# Altium schematic sheet SD_CARD.SchDoc
size A
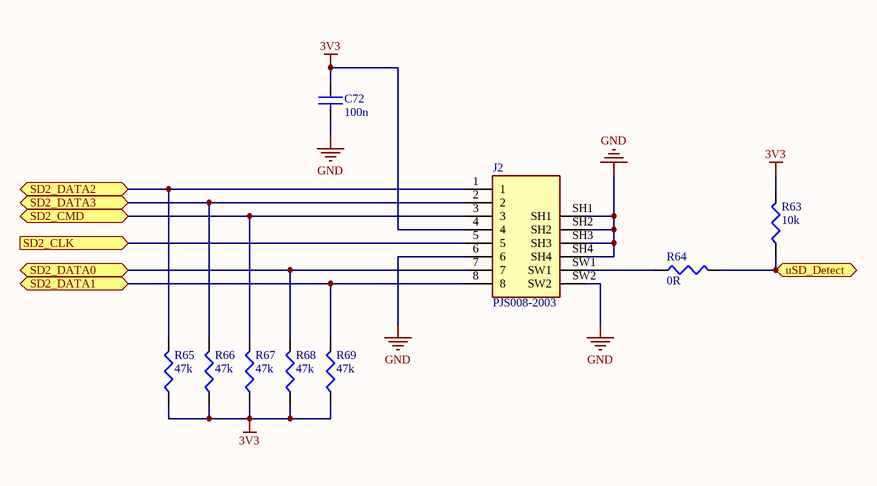
[diagram p0: SD_CARD.SchDoc]

## Parts
C72  100n  [C0402]
J2  PJS008-2003  [PJS008-2003-noHole]
R63  10k  [R0402]
R64  0R  [R0402]
R65  47k  [R0402]
R66  47k  [R0402]
R67  47k  [R0402]
R68  47k  [R0402]
R69  47k  [R0402]

## Ports
SD2_CLK (in), SD2_CMD (bidir), SD2_DATA0 (bidir), SD2_DATA1 (bidir), SD2_DATA2 (bidir), SD2_DATA3 (bidir), uSD_Detect (bidir)

## Nets
3V3: C72.1 J2.4 R63.2 R65.1 R66.1 R67.1 R68.1 R69.1
GND: C72.2 J2.6 J2.SH1 J2.SH2 J2.SH3 J2.SH4 J2.SW2
SD2_CLK: J2.5 ; port SD2_CLK
SD2_CMD: J2.3 R67.2 ; port SD2_CMD
SD2_DATA0: J2.7 R68.2 ; port SD2_DATA0
SD2_DATA1: J2.8 R69.2 ; port SD2_DATA1
SD2_DATA2: J2.1 R65.2 ; port SD2_DATA2
SD2_DATA3: J2.2 R66.2 ; port SD2_DATA3
uSD_Detect: R63.1 R64.2 ; port uSD_Detect
NetJ2_SW1: J2.SW1 R64.1

## Library data of the parts
C72 = C1005X5R1H104K: CAP CER .10UF 50V X5R 10% 0402; Manufacturer: TDK Corporation; Capacitance: 0.1µF; Value: 100nF; .Checked PCB: used; Category: Capacitors; Supplier Part Number: 445-5942-1-ND; Manufacturer Part Number: C1005X5R1H104K; Operating Temperature: -55°C ~ 85°C; Package / Case: 0402 (1005 Metric); Price 1k [$]: 0.02340; .Checked SCH: used; Voltage - Rated: 50V; Supplier: Digikey; Supplier 1: Digi-Key; Supplier Part Number 1: 445-5942-1-ND; RoHS: RoHS Compliant; Stock 1: 106926; Pricing 1: 1=0.27, 10=0.18, 100=0.072, 250=0.05176, 500=0.0369, 1000=0.027 (USD); Tolerance: ±10%; Temperature Coefficient: X5R; Mounting Type: Surface Mount, MLCC; Applications: General Purpose; Ratings: -; Size / Dimension: 0.039" L x 0.020" W (1.00mm x 0.50mm); Height - Seated (Max): -; Thickness (Max): 0.022" (0.55mm); Lead Spacing: -; Features: -; Packaging: Cut Tape (CT); Lead Style: -; ComponentLink1URL: http://www.tdk.co.jp/tefe02/e412_c.pdf; ComponentLink1Description: http://www.tdk.co.jp/tefe02/e412_c.pdf
J2 = PJS008-2003_noHole: Connector; Manufacturer_Name: Yamaichi; Manufacturer_Part_Number: PJS008-2003-1; Datasheet Link: https://www.mouser.com/datasheet/2/448/yamaichi_electronics_yeui-s-a0004672260-1-1694640.pdf; Height: 1.85mm; Mouser Part Number: 945-PJS008-2003-1; Mouser Price/Stock: https://www.mouser.com/Search/Refine.aspx?Keyword=945-PJS008-2003-1; Supplier 1: Mouser; Supplier Part Number 1: 945-PJS008-2003-0
R63 = RC0402FR-0710KL: RES 10.0K OHM 1/16W 1% 0402 SMD; Manufacturer: Yageo; Power (Watts): 0.063W, 1/16W; .Checked PCB: used; Temperature Coefficient: ±100ppm/°C; Category: Resistors; Supplier Part Number: 311-10.0KLRCT-ND; Manufacturer Part Number: RC0402FR-0710KL; Package / Case: 0402 (1005 Metric); Price 1k [$]: 0.01421; Resistance (Ohms): 10K; Tolerance: ±1%; Value: 10k; .Checked SCH: used; Supplier: Digikey; Supplier 1: Digi-Key; Supplier Part Number 1: 311-10.0KLRCT-ND; RoHS: RoHS Compliant; Stock 1: 2916495; Pricing 1: 10=0.014, 50=0.0104, 100=0.0079, 250=0.00584, 500=0.00432, 1000=0.00288 (USD); Composition: Thick Film; Features: -; Size / Dimension: 0.039" L x 0.020" W (1.00mm x 0.50mm); Height: 0.016" (0.40mm); Number of Terminations: 2; Packaging: Cut Tape (CT); ComponentLink1URL: http://www.yageo.com/documents/recent/PYu-RC0402_51_RoHS_L_6.pdf; ComponentLink1Description: http://www.yageo.com/documents/recent/PYu-RC0402_51_RoHS_L_6.pdf
R64 = CRCW0402330RFKED: RES 330 OHM 1/16W 1% 0402 SMD; Manufacturer: Vishay Dale; Resistance (Ohms): 330; Power (Watts): 0.063W, 1/16W; Temperature Coefficient: ±100ppm/°C; .Checked PCB: RF; Supplier 1: Digi-Key; Supplier Part Number 1: 541-330LCT-ND; Manufacturer Part Number: CRCW0402330RFKED; RoHS: RoHS Compliant; Category: Resistors; Stock 1: 49303; Pricing 1: 10=0.083, 50=0.0444, 200=0.0255, 1000=0.0174 (USD); Composition: Thick Film; Features: -; Tolerance: ±1%; Package / Case: 0402 (1005 Metric); Size / Dimension: 0.039" L x 0.020" W (1.00mm x 0.50mm); Height: 0.016" (0.40mm); Number of Terminations: 2; Packaging: Cut Tape (CT); ComponentLink1URL: http://www.vishay.com/doc?20035; ComponentLink1Description: http://www.vishay.com/doc?20035; .Checked SCH: RF
R65-R69 = RC0402FR-0710KL: RES 10.0K OHM 1/16W 1% 0402 SMD; Manufacturer: Yageo; Resistance (Ohms): 10K; Power (Watts): 0.063W, 1/16W; Value: 10k; .Checked PCB: used; Temperature Coefficient: ±100ppm/°C; Category: Resistors; Supplier Part Number: 311-10.0KLRCT-ND; Manufacturer Part Number: RC0402FR-0710KL; Package / Case: 0402 (1005 Metric); Price 1k [$]: 0.01421; Tolerance: ±1%; .Checked SCH: used; Supplier: Digikey; Supplier 1: Digi-Key; Supplier Part Number 1: 311-10.0KLRCT-ND; RoHS: RoHS Compliant; Stock 1: 2916495; Pricing 1: 10=0.014, 50=0.0104, 100=0.0079, 250=0.00584, 500=0.00432, 1000=0.00288 (USD); Composition: Thick Film; Features: -; Size / Dimension: 0.039" L x 0.020" W (1.00mm x 0.50mm); Height: 0.016" (0.40mm); Number of Terminations: 2; Packaging: Cut Tape (CT); ComponentLink1URL: http://www.yageo.com/documents/recent/PYu-RC0402_51_RoHS_L_6.pdf; ComponentLink1Description: http://www.yageo.com/documents/recent/PYu-RC0402_51_RoHS_L_6.pdf